# Altium schematic sheet Input Sense Network.SchDoc
size A4
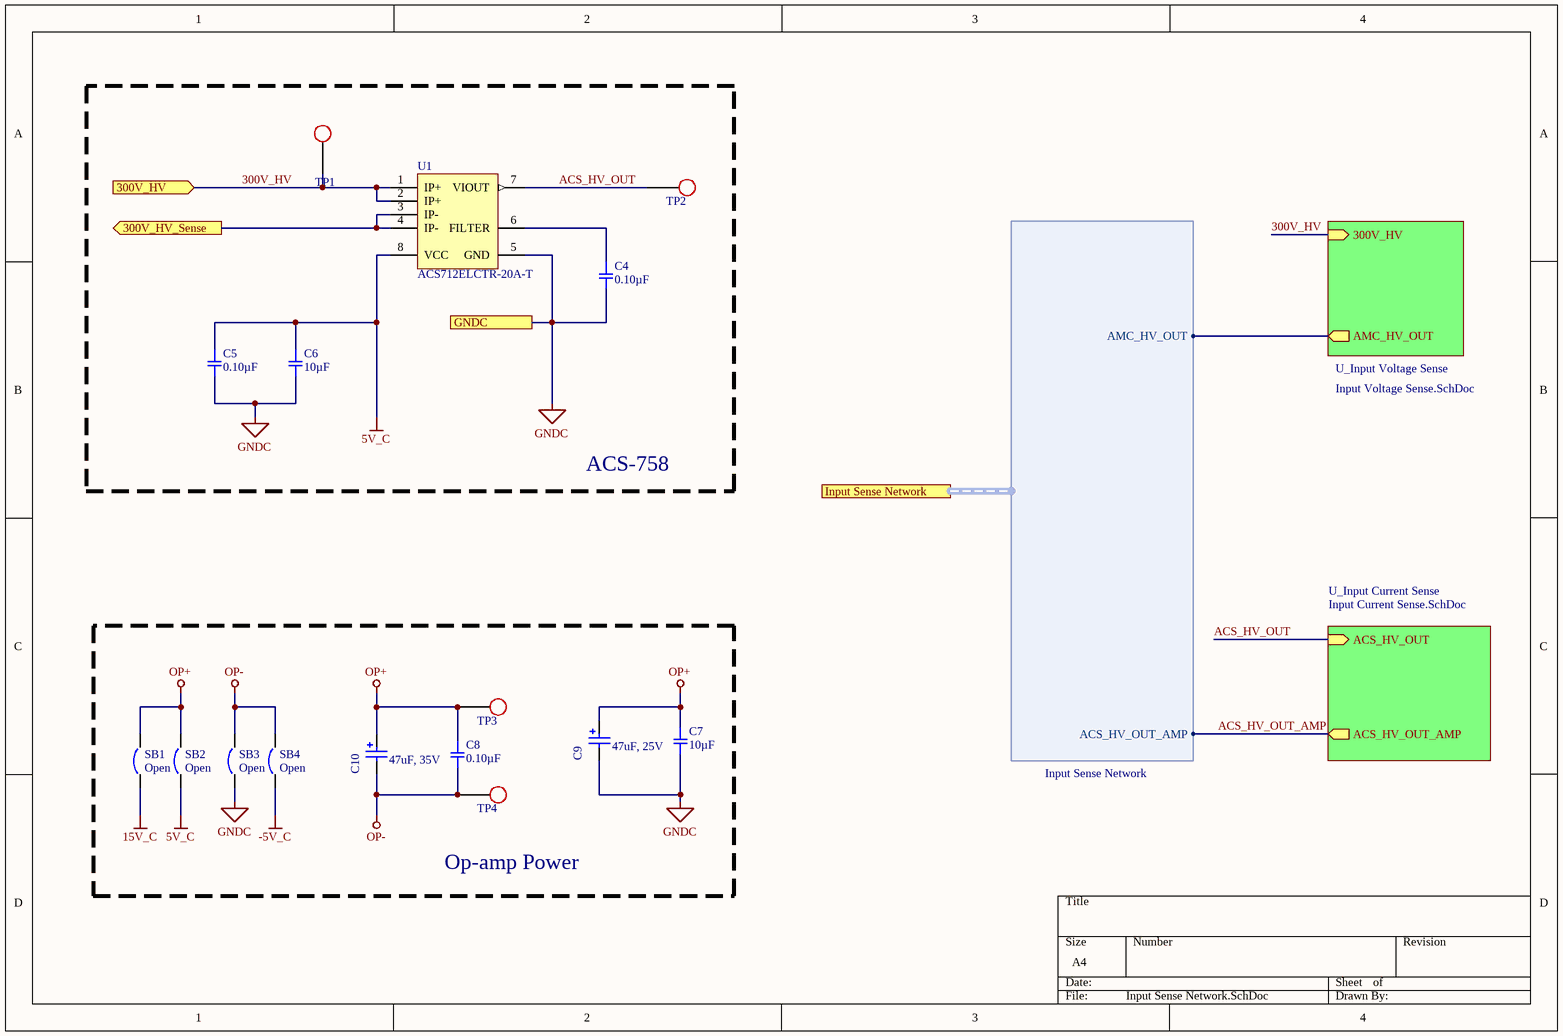
[diagram p0: Input Sense Network.SchDoc]

## Parts
C4  0.10µF  [SMD-0805C]
C5  0.10µF  [SMD-0805C]
C6  10µF  [SMD-0805C]
C7  10µF  [SMD-0805C]
C8  0.10µF  [SMD-0805C]
C9  47uF, 25V  [WCAP-ASLU_6.3x7.7]
C10  47uF, 35V  [WCAP-ASLL_6.3x5.5]
SB1  Open  [0805-Solder Bridge]  (no BOM)
SB2  Open  [0805-Solder Bridge]  (no BOM)
SB3  Open  [0805-Solder Bridge]  (no BOM)
SB4  Open  [0805-Solder Bridge]  (no BOM)
TP1  Test Point  [Test_point_THT]  (value not drawn)  (no BOM)
TP2  Test Point  [Test_point_THT]  (value not drawn)  (no BOM)
TP3  Test Point  [Test_point_THT]  (value not drawn)  (no BOM)
TP4  Test Point  [Test_point_THT]  (value not drawn)  (no BOM)
U1  ACS712ELCTR-20A-T  [SOIC127P570X175_HS-9N]

## Blocks framed on the sheet
ACS-758: C4-C6 TP1 TP2 U1
Op-amp Power: C7-C10 SB1-SB4 TP3 TP4

## Sub-sheets
U_Input Current Sense = Input Current Sense.SchDoc: ACS_HV_OUT (in), ACS_HV_OUT_AMP (out)
U_Input Voltage Sense = Input Voltage Sense.SchDoc: 300V_HV (in), AMC_HV_OUT (out)

## Ports
300V_HV (in), 300V_HV_Sense (out), GNDC, Input Sense Network (harness Input Sense Network)

## Harnesses
Input Sense Network: ACS_HV_OUT_AMP, AMC_HV_OUT

## Nets
5V_C: C5.1 C6.1 SB2.1 U1.8(VCC)
15V_C: SB1.1
-5V_C: SB4.1
GNDC: C4.2 C5.2 C6.2 C7.2 C9.1(N) SB3.1 U1.5(GND) ; port GNDC
OP+: C7.1 C8.1 C9.2(P) C10.2(P) SB1.2 SB2.2 TP3.1
OP-: C8.2 C10.1(N) SB3.2 SB4.2 TP4.1
300V_HV: TP1.1 U1.1(IP+) U1.2(IP+) ; port 300V_HV, sheet U_Input Voltage Sense/300V_HV
300V_HV_Sense: U1.3(IP-) U1.4(IP-) ; port 300V_HV_Sense
ACS_HV_OUT: TP2.1 U1.7(VIOUT) ; sheet U_Input Current Sense/ACS_HV_OUT
ACS_HV_OUT_AMP: sheet U_Input Current Sense/ACS_HV_OUT_AMP, port Input Sense Network.ACS_HV_OUT_AMP
NetC4_1: C4.1 U1.6(FILTER)
(unnamed): sheet U_Input Voltage Sense/AMC_HV_OUT, port Input Sense Network.AMC_HV_OUT

## Library data of the parts
C4 C5 C8 = GCD21BR71H104KA01L: CAP CER 0.1UF 50V X7R 0805; Manufacturer: Murata Electronics North America; Factory Stock: 0; Unit Price (USD): 0.24; Minimum Quantity: 1; Tolerance: ±10%; Datasheets: http://www.murata.com/~/media/webrenewal/support/library/catalog/products/capacitor/mlcc/c03e.ashx; Image: //media.digikey.com/Renders/Murata%20Renders/0805%28GxM6%29.jpg; Digi-Key Part Number: 490-11955-1-ND; Part Number: GCD21BR71H104KA01L; Quantity Available: 157; @ qty: 0; Packaging: Cut Tape (CT); Series: GCD; Part Status: Active; Value: 0.10µF; Voltage: 50V; Temperature Coefficient: X7R; Operating Temperature: -55°C ~ 125°C; Features: -; Ratings: AEC-Q200; Applications: Automotive; Mounting Type: Surface Mount, MLCC; Package / Case: 0805 (2012 Metric); Size / Dimension: 0.079" L x 0.049" W (2.00mm x 1.25mm); Height - Seated (Max): -; Thickness (Max): 0.049" (1.25mm); Lead Spacing: -; Lead Style: -
C6 C7 = GCJ21BR71A106KE01L: CAP CER 10UF 10V X7R 0805; Manufacturer: Murata Electronics North America; Factory Stock: 0; Unit Price (USD): 0.56; Minimum Quantity: 1; Tolerance: ±10%; Datasheets: http://www.murata.com/~/media/webrenewal/support/library/catalog/products/capacitor/mlcc/c03e.ashx; Image: //media.digikey.com/Renders/Murata%20Renders/0805%20(2012%20Metric)%20.85mm.jpg; Digi-Key Part Number: 490-12646-1-ND; Part Number: GCJ21BR71A106KE01L; Quantity Available: 2702; @ qty: 0; Packaging: Cut Tape (CT); Series: GCJ; Part Status: Active; Value: 10µF; Voltage: 10V; Temperature Coefficient: X7R; Operating Temperature: -55°C ~ 125°C; Features: Soft Termination; Ratings: AEC-Q200; Applications: Automotive, Boardflex Sensitive; Mounting Type: Surface Mount, MLCC; Package / Case: 0805 (2012 Metric); Size / Dimension: 0.079" L x 0.049" W (2.00mm x 1.25mm); Height - Seated (Max): -; Thickness (Max): 0.057" (1.45mm); Lead Spacing: -; Lead Style: -
C9 = 865090445006: WCAP-ASLU Aluminium Electrolytic Capacitors, D6.3mm x L7.7mm, 47uF, +/-20%, 25VDC; Dissipation Factor: 16%; Leakage Current: 2.35uA; Endurance: 1000h; Technical Reference: ASBD077470M025DVCTCA000; Ripple Current max.: 65mA; ComponentLink1Description: Manufacturer; ComponentLink1URL: http://www.we-online.de; ComponentLink2Description: Datasheet; ComponentLink2URL: https://katalog.we-online.com/pbs/datasheet/865090445006.pdf; Mounting Technology: SMD; Operating Temperature: -40 to +85degC; Packaging: Tape and Reel; Part Number: 865090445006; Publisher: Wurth Elektronik; Capacitance: 47uF; Diameter: 6.3mm; Length: 7.7mm; Published Date: August 2019; Rated Voltage: 25VDC; Capacitance Tolerance: +/-20%
C10 = 865060543005: WCAP-ASLL SMT Aluminum Electrolytic Capacitors, D6.3mm x L5.5mm, 47uF, +/-20%, 35VDC; Dissipation Factor: 14%; Endurance: 2000h; Leakage Current: 16.45uA; Ripple Current max.: 240mA; Technical Reference: ASED055470M035DVCTBB000; ComponentLink1Description: Manufacturer; ComponentLink1URL: http://www.we-online.de; ComponentLink2Description: Datasheet; ComponentLink2URL: https://katalog.we-online.com/pbs/datasheet/865060543005.pdf; Length: 5.5mm; Mounting Technology: SMT; Operating Temperature: -55 to +105degC; Packaging: Tape and Reel; Published Date: August 2019; Capacitance: 47uF; Diameter: 6.3mm; Part Number: 865060543005; Publisher: Wurth Elektronik; Capacitance Tolerance: +/-20%; Rated Voltage: 35VDC
SB1-SB4 = Solder Bridge: Circuit Breaker; Published: 24-Mar-1999; Revision: July-2002: Re-released for DXP Platform.; Publisher: Altium Limited
TP1-TP4 = Test Point: TP
U1 = ACS712: Linear Current Sensor IC, 4.5 to 5.5 V Supply Voltage, 10 mA Supply Current, -40 to 85 degC, 8-Pin SOIC (LC), RoHS, Tape and Reel; Manufacturer: Allegro Microsystems; CLOAD: 10 nF Max.; ICC: 10 mA; F: 80 kHz; RLOAD: 4.7 kOhm Min.; Optimized Accuracy Range: +/- 20 A; TR: 3.5 us; Sensitivity Sens: 100 mV/A Typ.; Operating Temperature Range: -40 to 85 degC; ComponentLink2URL: http://www.allegromicro.com/~/media/Files/Datasheets/ACS712-Datasheet.ashx; ComponentLink1Description: Manufacturer URL; VCC: 4.5 to 5.5 V; Mounting Technology: Surface Mount; DatasheetVersion: Rev. 15; ComponentLink2Description: Datasheet; ComponentLink1URL: http://www.allegromicro.com/; PackageDescription: 8-Pin SOIC, Body 4.9 x 3.9 mm, Pitch 1.27 mm; PackageReference: LC-8; RoHS: TRUE; Packing: Tape and Reel; PartNumber: ACS712ELCTR-20A-T